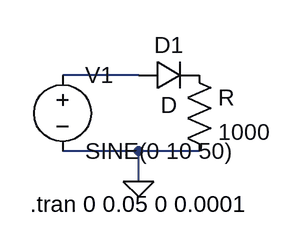
[diagram p0: schematic Retificador_meia_onda.asc]
Retificador_meia_onda.asc, the LTspice schematic file:
Version 4
SHEET 1 880 680
WIRE 176 -176 96 -176
WIRE 176 -96 96 -96
WIRE 240 -96 176 -96
WIRE 176 -64 176 -96
FLAG 176 -64 0
SYMBOL diode 176 -160 R270
WINDOW 0 32 32 VTop 2
WINDOW 3 0 32 VBottom 2
SYMATTR InstName D1
SYMBOL res 224 -192 R0
SYMATTR InstName R
SYMATTR Value 1000
SYMBOL voltage 96 -192 R0
WINDOW 123 0 0 Left 0
WINDOW 39 0 0 Left 0
SYMATTR InstName V1
SYMATTR Value SINE(0 10 50)
TEXT 62 -40 Left 2 !.tran 0 0.05 0 0.0001

The netlist it stands for:
* Retificador_meia_onda.asc
D1 N001 P001 D
R P001 0 1000
V1 N001 0 SINE(0 10 50)
.model D D
.lib standard.dio
.tran 0 0.05 0 0.0001
.backanno
.end